# Altium schematic sheet 1_接口.schdoc.schdoc
size 309 x 223 mm; Symbol: Sheet-Symbol_A4; Device: Sheet-Symbol_A4; Company: 嘉立创EDA; Drawed: 吴登珂; Version: V1.0; Page Size: A4; @Project Name: TB6612; @Page Count: 4; @Update Date: 2024-04-14; @Create Date: 2024-04-14; @Schematic Name: Schematic1; @Page No: 4; @Page Name: 接口
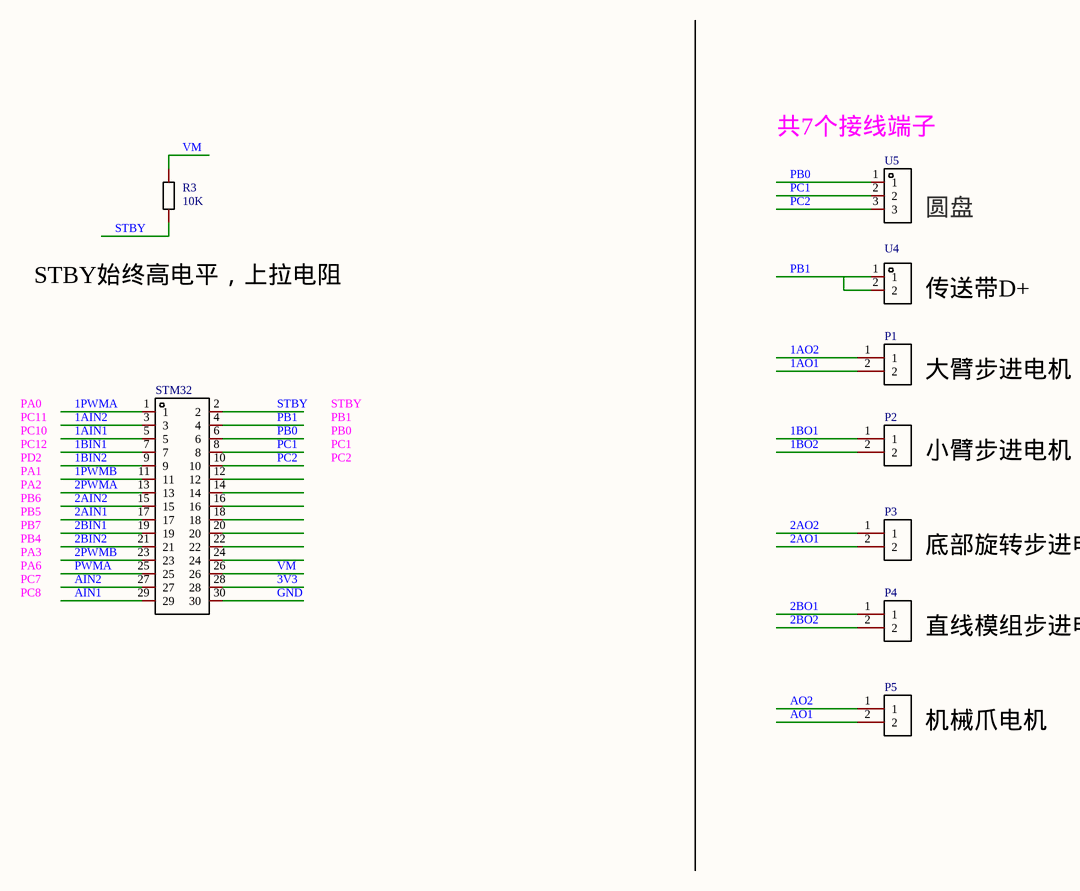
[diagram p0: 1_接口.schdoc.schdoc]

## Parts
P1  WJ500V-5.08-2P  [CONN-TH_2P-P5.00_WJ500V-5.08-2P]  (value not drawn)
P2  WJ500V-5.08-2P  [CONN-TH_2P-P5.00_WJ500V-5.08-2P]  (value not drawn)
P3  WJ500V-5.08-2P  [CONN-TH_2P-P5.00_WJ500V-5.08-2P]  (value not drawn)
P4  WJ500V-5.08-2P  [CONN-TH_2P-P5.00_WJ500V-5.08-2P]  (value not drawn)
P5  WJ500V-5.08-2P  [CONN-TH_2P-P5.00_WJ500V-5.08-2P]  (value not drawn)
R3  10K  [R0603]
STM32  PM254-2-15-Z-8.5  [HDR-TH_30P-P2.54-V-F-R2-C15-S2.54-2]  (value not drawn)
U4  DB136HA-10.16-1P-S  [CONN-TH_DIBO_DB136HA-10.16-1P-S]  (value not drawn)
U5  XY128V-A-5.08-3P  [CONN-TH_XY128V-A-5.08-3P]  (value not drawn)

## Nets
1AIN1: STM32.5
1AIN2: STM32.3
1AO1: P1.2
1AO2: P1.1
1BIN1: STM32.7
1BIN2: STM32.9
1BO1: P2.1
1BO2: P2.2
1PWMA: STM32.1
1PWMB: STM32.11
2AIN1: STM32.17
2AIN2: STM32.15
2AO1: P3.2
2AO2: P3.1
2BIN1: STM32.19
2BIN2: STM32.21
2BO1: P4.1
2BO2: P4.2
2PWMA: STM32.13
2PWMB: STM32.23
3V3: STM32.28
AIN1: STM32.29
AIN2: STM32.27
AO1: P5.2
AO2: P5.1
GND: STM32.30
PB0: STM32.6 U5.1
PB1: STM32.4 U4.1 U4.2
PC1: STM32.8 U5.2
PC2: STM32.10 U5.3
PWMA: STM32.25
STBY: R3.1 STM32.2
VM: R3.2 STM32.26

Not connected (* = marked no-connect by the designer): STM32 12 14 16 18 20 22 24

## Notes on the sheet
- (near U5) 共7个接线端子
- (near U5) 圆盘
- STBY始终高电平，上拉电阻
- (near U4) 传送带D+
- (near P1) 大臂步进电机
- PA0
- PC10
- PC11
- PC12
- PB1
- PB0
- PC1
- STBY
- PA1
- PA2
- PD2
- PB5
- PB6
- PC2
- (near P2) 小臂步进电机
- PA3
- PA6
- PC7
- PB7
- PB4
- (near P3) 底部旋转步进电机
- PC8
- (near P4) 直线模组步进电机平移
- (near P5) 机械爪电机
- 1
- 2
- 3
- 4
- 5
- 6
- A
- B
- C
- 原理图
- Schematic1
- 创建日期
- 更新日期
- 2024-04-14
- 审阅
- 绘制
- 图页
- 吴登珂
- 接口
- 物料编码
- TB6612
- D
- 版本
- 尺寸
- 页
- 共
- V1.0
- A4
- 嘉立创EDA

## Library data of the parts
P1-P5 = WJ500V-5.08-2P: Manufacturer: KANGNEX(康奈克斯电气); Symbol: WJ500V-5.08-2P-14-00A; Add into BOM: yes; Structure: 1x2P; Pitch: 5.08mm; Current Rating (Max): 18A; Voltage Rating (Max): 250V; Wire Gauge - AWG: 14~30; Wire Gauge - mm2: 2.5; Number of PINs Per Row: 2; Description: 结构:1x2P;间距:5.08mm;颜色:绿色;安装方式:直插;额定电流:18A;额定电压:250V;排数:1;线规 - AWG:14~30;线规 - 平方毫米:2.5;每排PIN数:2;工作温度范围:-40℃~+105℃;; Device: WJ500V-5.08-2P; Supplier: LCSC; Manufacturer Part: WJ500V-5.08-2P; Supplier Part: C8465; JLCPCB Part Class: 扩展库; LCSC Part Name: 5.08mm 1x2P 排数:1 每排P数:2 直插; Supplier Footprint: 插件,P=5.08mm; Datasheet: https://atta.szlcsc.com/upload/public/pdf/source/20191225/C8465_02D34CE5B5B4A53DF5891601D97FA9F4.pdf; Convert to PCB: yes; Color: 绿色; Mounting Style: 直插; Number of Pins: 2P; Number of Rows: 1; Operating Temperature Range: -40℃~+105℃
  P2 P4: Name: WJ500V-5.08-2P
R3 = Res_0603: Symbol: 电阻; Convert to PCB: yes; Name: 10K; Device: Res_0603; Add into BOM: yes; Supplier Footprint: 0603; Value: 10K
STM32 = PM254-2-15-Z-8.5: Manufacturer: HCTL(华灿天禄); Add into BOM: yes; Holes Structure: 2x15P; Pitch: 2.54mm; Circular Hole / Square Hole: 方孔; Number of Holes: 30P; Current Rating (Max): 3A; Holes Direction: 顶部; Soldering Temperature(Max): 260℃@5S; Description: 插孔结构:2x15P;间距:2.54mm;行距:2.54mm;圆孔/方孔:方孔;安装类型:直插;排数:双排;总孔位数:30P;额定电流:3A;额定电压:-;插孔方向:顶部;塑高:8.5mm;触头材质:铜合金;工作温度范围:-40℃~+105℃;焊接温度(最大值):260℃@5S;; Name: PM254-2-15-Z-8.5; Symbol: PM254-2-15-Z-8.5; Device: PM254-2-15-Z-8.5; LCSC Part Name: 2x15P 间距:2.54mm 直插; Supplier Part: C2897416; Manufacturer Part: PM254-2-15-Z-8.5; Supplier Footprint: 插件,P=2.54mm; JLCPCB Part Class: 扩展库; Datasheet: https://atta.szlcsc.com/upload/public/pdf/source/20230609/3D36CA2C1BFC9FD1C3F709AD9DFEB9C2.pdf; Supplier: LCSC; Convert to PCB: yes; Row Spacing: 2.54mm; Mounting Type: 直插; Number of Rows: 双排; Voltage Rating (Max): -; Insulation Height: 8.5mm; Contact Material: 铜合金; Operating Temperature Range: -40℃~+105℃
U4 = DB136HA-10.16-1P-S: Manufacturer: DORABO(地博电气); Add into BOM: yes; Structure: 1x1P; Pitch: 10.16mm; Current Rating (Max): 65A; Voltage Rating (Max): 600V; Wire Gauge - AWG: 6~20; Number of PINs Per Row: 1; Description: 结构:1x1P;间距:10.16mm;颜色:绿色;安装方式:直插;额定电流:65A;额定电压:600V;排数:1;线规 - AWG:6~20;每排PIN数:1;工作温度范围:-40℃~+105℃;; Name: DB136HA-10.16-1P-S; Symbol: DB136HA-10.16-1P-S; Device: DB136HA-10.16-1P-S; LCSC Part Name: 10.16mm 1x1P 排数:1 每排P数:1 直插; Supplier Part: C2909065; Manufacturer Part: DB136HA-10.16-1P-S; Supplier Footprint: 插件,P=10.16mm; JLCPCB Part Class: 扩展库; Datasheet: https://atta.szlcsc.com/upload/public/pdf/source/20230106/9FC1C510F98EF526BE9E34B2895667E7.pdf; Supplier: LCSC; Convert to PCB: yes; Color: 绿色; Mounting Style: 直插; Number of Pins: 1P; Number of Rows: 1; Operating Temperature Range: -40℃~+105℃
U5 = XY128V-A-5.08-3P: Manufacturer: XINLAIYA(新莱亚); Add into BOM: yes; Structure: 1x3P; Pitch: 5.08mm; Current Rating (Max): 15A; Voltage Rating (Max): 300V; Wire Gauge - AWG: 12~24; Wire Gauge - mm2: 2.5; Number of PINs Per Row: 3; Description: 结构:1x3P;间距:5.08mm;颜色:绿色;安装方式:直插;额定电流:15A;额定电压:300V;排数:1;线规 - AWG:12~24;线规 - 平方毫米:2.5;每排PIN数:3;工作温度范围:-;; Name: XY128V-A-5.08-3P; Symbol: XY128V-A-5.08-3P; Device: XY128V-A-5.08-3P; Supplier: LCSC; Supplier Part: C557666; Manufacturer Part: XY128V-A-5.08-3P; JLCPCB Part Class: 扩展库; LCSC Part Name: 5.08mm 1x3P 排数:1 每排P数:3 直插; Supplier Footprint: 插件,P=5.08mm; Datasheet: https://atta.szlcsc.com/upload/public/pdf/source/20200527/C557663_965673E12F0DA50AFE0C050081E55359.pdf; Convert to PCB: yes; Color: 绿色; Mounting Style: 直插; Number of Pins: 3P; Number of Rows: 1; Operating Temperature Range: -